# Altium schematic sheet MY_DEMO.SchDoc
size A3
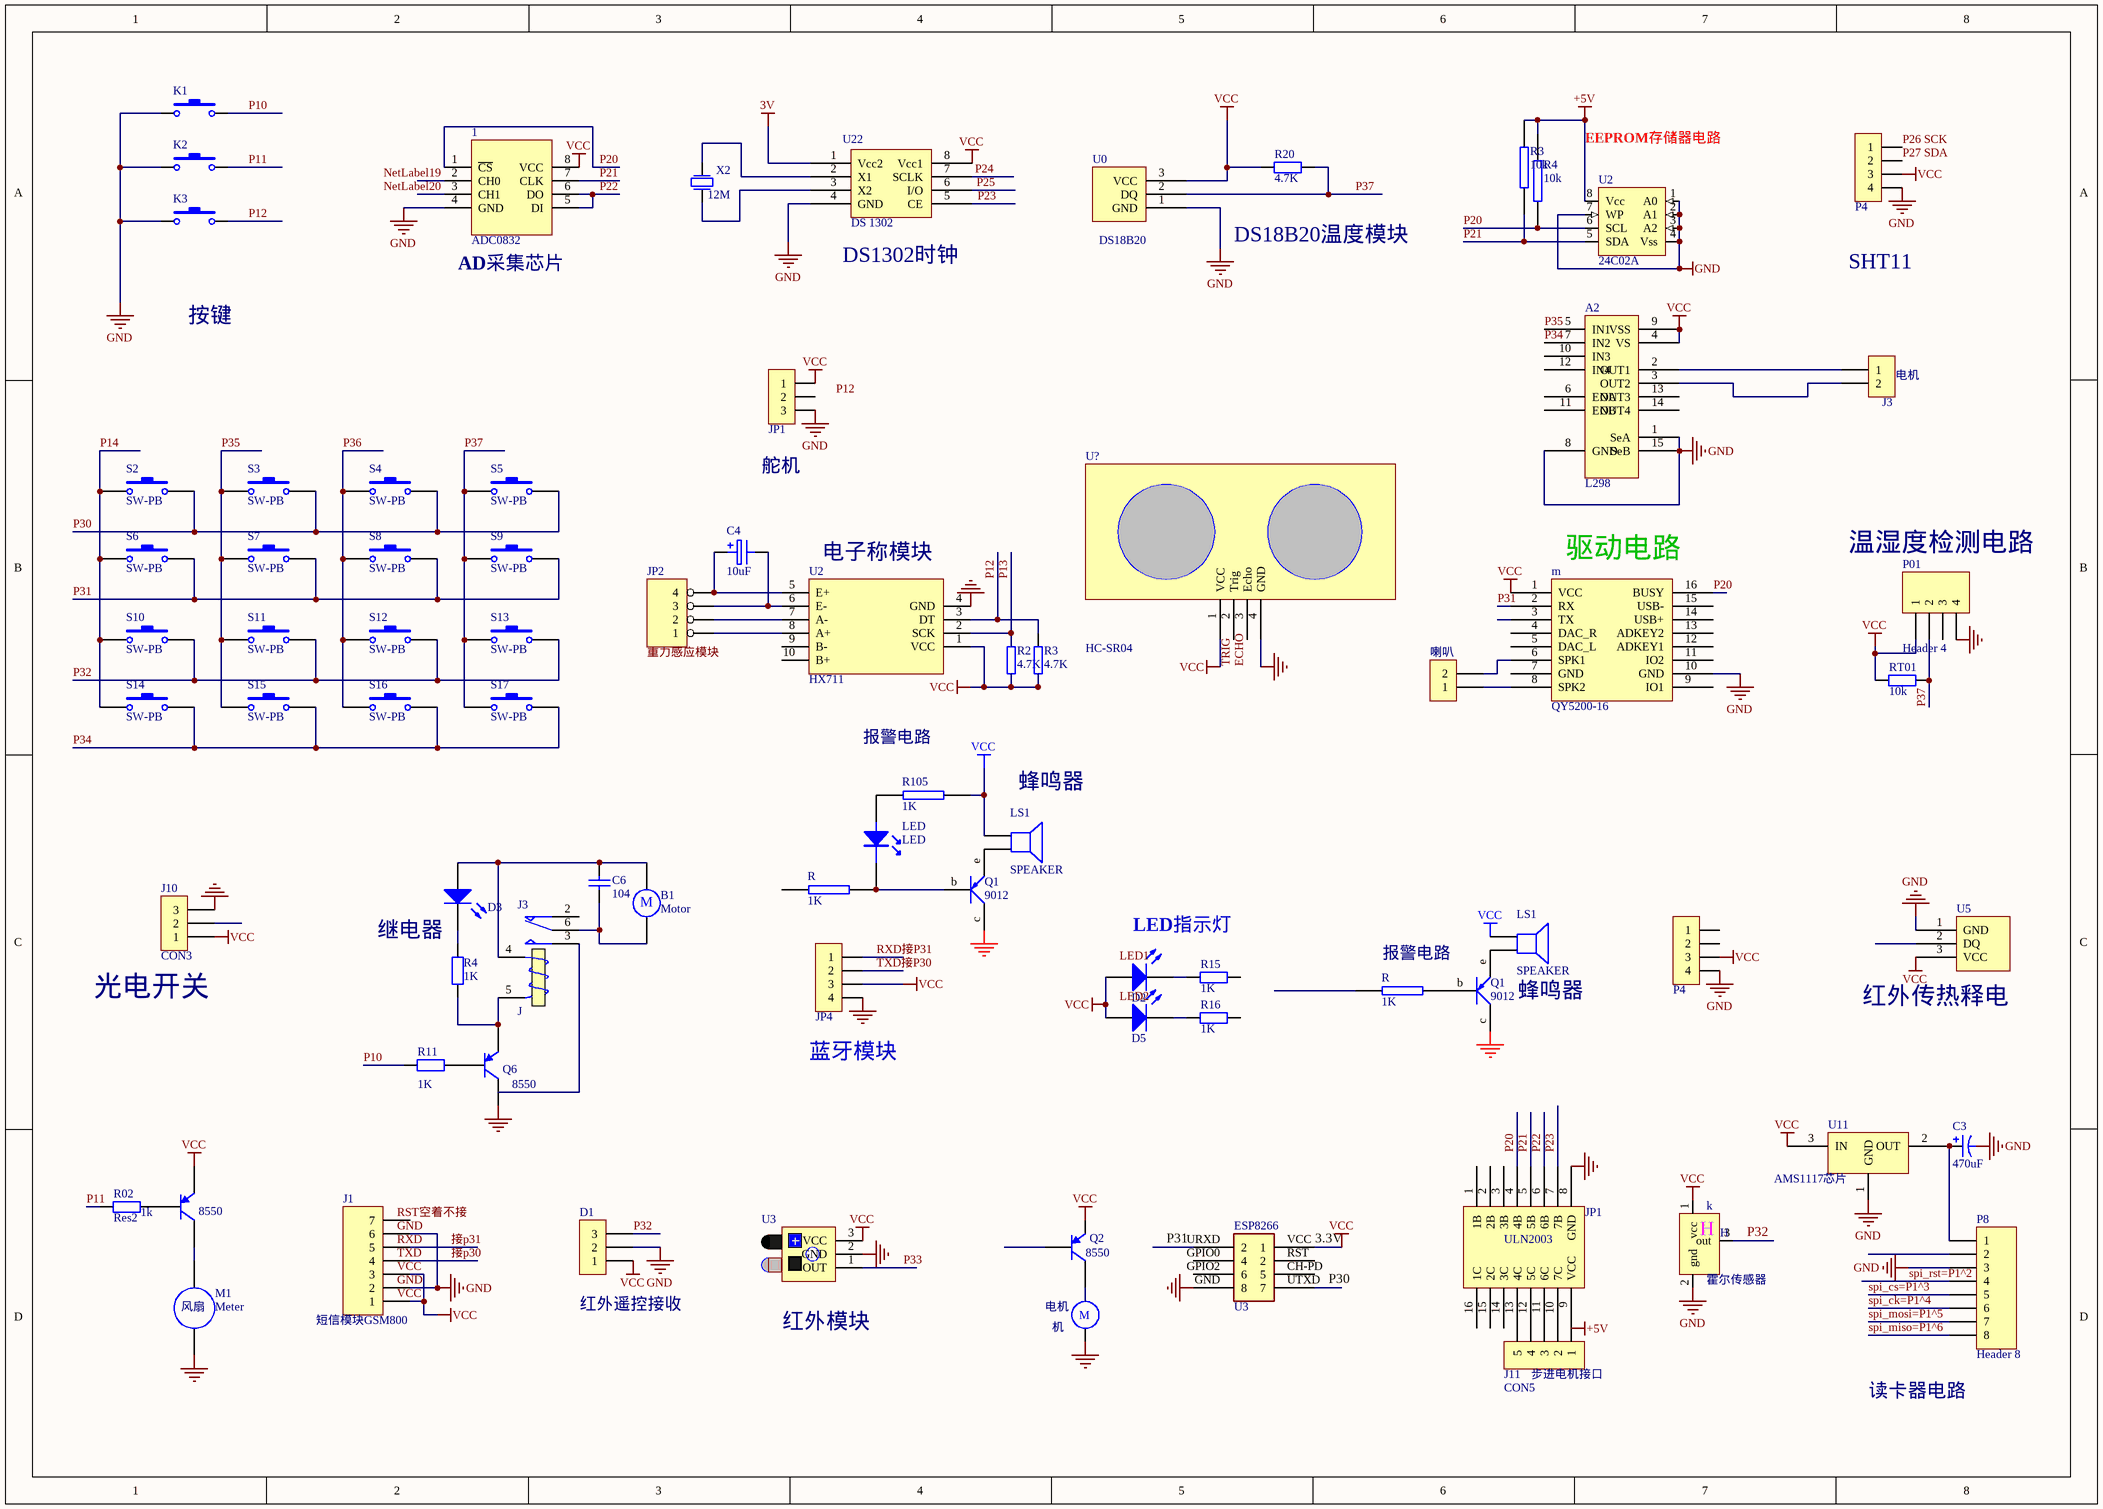
[diagram p0: MY_DEMO.SchDoc]

## Parts
(Parts that share a designator on the sheet are numbered #1, #2 ... from top to bottom, then left to right.)
1  ADC0832
?  8550  [BCY-W3/E4]
A2  L298  [MULTI15]
B1  Motor  [2ZHEN]
C3  470uF  [电解电容]
C4  10uF  [CD5.254]
C6  104  [RAD0.1]
D1  (no value)
D2  LED  [led]  (value not drawn)
D3  LED  [led]  (value not drawn)
D5  LED  [led]  (value not drawn)
ESP8266  U3  [HDR2X4]
J1  短信模块GSM800  [HDR1X7]
J3#1  电机  [SIP2]
J3#2  J  [JIDIANQI]
J10  CON3
J11  CON5  [SIP5]
JP1#1  HDR-1X3  [HDR-1X3]  (value not drawn)
JP1#2  ULN2003  [DIP16]
JP2  (no value)  [SIP4]
JP4  HDR-1X4  [HDR-1X4]  (value not drawn)
k  H  [DS18B20]
K1  KEY  [TSW SMD-4*4*1.5]  (value not drawn)
K2  KEY  [TSW SMD-4*4*1.5]  (value not drawn)
K3  KEY  [TSW SMD-4*4*1.5]  (value not drawn)
LED  LED  [LED]
LS1#1  SPEAKER
LS1#2  SPEAKER
m  QY5200-16  [QY5200]
M1  Meter  [RAD-0.1]
P01  Header 4  [HDR1X4]
P4#1  HDR-1X4  [HDR-1X4]  (value not drawn)
P4#2  HDR-1X4  [HDR-1X4]  (value not drawn)
P8  Header 8  [HDR1X8]
Q1#1  9012  [TO-92B]
Q1#2  9012  [TO-92B]
Q2  8550  [SJG-EBC]
Q6  8550  [TO-sanjiguan]
R2  4.7K  [1/4W]
R02  Res2  value 1k  [AXIAL-0.4]
R3#1  10k  [1/4W]
R3#2  4.7K  [1/4W]
R4#1  10k  [1/4W]
R4#2  1K  [RES]
R11  1K  [AXIAL-0.3]
R15  1K  [RES]
R16  1K  [RES]
R20  value 4.7K  [直插式电阻]  (hidden comment: Res2)
R105  1K  [0805]
R#1  1K  [R-DIP]
R#2  1K  [R-DIP]
RT01  value 10k  [AXIAL-0.3]  (hidden comment: Res2)
S2  SW-PB  [SPST-2]
S3  SW-PB  [SPST-2]
S4  SW-PB  [SPST-2]
S5  SW-PB  [SPST-2]
S6  SW-PB  [SPST-2]
S7  SW-PB  [SPST-2]
S8  SW-PB  [SPST-2]
S9  SW-PB  [SPST-2]
S10  SW-PB  [SPST-2]
S11  SW-PB  [SPST-2]
S12  SW-PB  [SPST-2]
S13  SW-PB  [SPST-2]
S14  SW-PB  [SPST-2]
S15  SW-PB  [SPST-2]
S16  SW-PB  [SPST-2]
S17  SW-PB  [SPST-2]
U0  DS18B20  [TO-92]
U2#1  24C02A  [DIP8]
U2#2  HX711  [HX711]
U3  (no value)
U5  红外传热释电  [DS18B20]
U11  AMS1117芯片  [AMS1117]
U22  DS 1302  [DS1302 - duplicate]
U?  HC-SR04  [HC-SR04]
X2  12M  [XTAL-3X10]
喇叭  (no value)
电机  机  [RB5-10.5]

## Nets
3.3V: 1.8(VCC) ?.1(E) A2.4(VS) A2.9(VSS) D1.1 D2.1(A) D5.1(A) ESP8266.VCC(1) J1.1 J1.3 J10.1 JP1#1.1 JP4.3 k.1(vcc) LS1#1.1 LS1#2.1 m.1(VCC) P01.1 P4#1.3 P4#2.3 R2.1 R3#2.1 R20.1 R105.1 RT01.2 U0.3(VCC) U2#2.1(VCC) U3.3(VCC) U5.3(VCC) U11.3(IN) U22.8(Vcc1) U?.1(VCC)  [also labelled VCC]
3V: U22.1(Vcc2)
+5V: JP1#2.9(VCC) R3#1.2 R4#1.2 U2#1.8(Vcc)
GND: 1.4(GND) A2.1(SeA) A2.8(GND) A2.15(SeB) D1.2 ESP8266.GND(8) J1.2 J1.6 J10.3 JP1#1.3 JP1#2.8(GND) JP4.4 k.2(gnd) K1.1 K2.1 K3.1 m.10(GND) M1.1 P01.4 P4#1.4 P4#2.4 P8.3 Q1#1.c Q1#2.c Q6.1(C) U0.1(GND) U2#1.1(A0) U2#1.2(A1) U2#1.3(A2) U2#1.4(Vss) U2#1.7(WP) U2#2.4(GND) U3.2(GND) U5.1(GND) U22.4(GND) U?.4(GND)
P10: K1.2 R11.1
P11: K2.2 R02.1
P12: K3.2 R3#2.2 U2#2.3(DT)
P13: R2.2 U2#2.2(SCK)
P14: S2.1 S6.1 S10.1 S14.1
P20: 1.1(~{CS}) JP1#2.4(4B) m.16(BUSY) R4#1.1 U2#1.6(SCL)
P21: 1.7(CLK) JP1#2.5(5B) R3#1.1 U2#1.5(SDA)
P22: 1.5(DI) 1.6(DO) JP1#2.6(6B)
P23: JP1#2.7(7B) U22.5(CE)
P24: U22.7(SCLK)
P25: U22.6(I/O)
P26 SCK: P4#1.1
P27 SDA: P4#1.2
P30: ESP8266.UTXD(7) S2.2 S3.2 S4.2 S5.2
P31: ESP8266.URXD(2) m.2(RX) S6.2 S7.2 S8.2 S9.2
P32: D1.3 k.3(out) S10.2 S11.2 S12.2 S13.2
P33: U3.1(OUT)
P34: A2.7(IN2) S14.2 S15.2 S16.2 S17.2
P35: A2.5(IN1) S3.1 S7.1 S11.1 S15.1
P36: S4.1 S8.1 S12.1 S16.1
P37: P01.2 R20.2 RT01.1 S5.1 S9.1 S13.1 S17.1 U0.2(DQ)
RXD接P31: JP4.1
spi_ck=P1^4: P8.6
spi_cs=P1^3: P8.5
spi_miso=P1^6: P8.8
spi_mosi=P1^5: P8.7
spi_rst=P1^2: P8.4
TXD接P30: JP4.2
接p30: J1.4
接p31: J1.5
Net?_2: ?.2(B) R02.2
Net?_3: ?.3(C) M1.2
NetA2_2: A2.2(OUT1) J3#1.1
NetA2_3: A2.3(OUT2) J3#1.2
NetB1_1: B1.1 C6.2 D3.1(A) J3#2.4(T1)
NetB1_2: B1.2 C6.1 J3#2.6(COM)
NetC3_1: C3.1 P8.1 U11.2(OUT)
NetC4_1: C4.1 JP2.4 U2#2.5(E+)
NetC4_2: C4.2 JP2.3 U2#2.6(E-)
NetD2_2: D2.2(K) R15.2
NetD3_2: D3.2(K) R4#2.2
NetD5_2: D5.2(K) R16.2
NetJ3#2_5: J3#2.5(T2) Q6.3(E) R4#2.1
NetJP2_1: JP2.1 U2#2.8(A+)
NetJP2_2: JP2.2 U2#2.7(A-)
NetLED_A: LED.A R105.2
NetLED_K: LED.K Q1#1.b R#1.1
NetLS1#1_2: LS1#1.2 Q1#1.e
NetLS1#2_2: LS1#2.2 Q1#2.e
Netm_6: m.6(SPK1) 喇叭.2
Netm_8: m.8(SPK2) 喇叭.1
NetQ1#2_b: Q1#2.b R#2.1
NetQ6_2: Q6.2(B) R11.2
NetU22_2: U22.2(X1) X2.1(P1)
NetU22_3: U22.3(X2) X2.2(P2)

Not connected (* = marked no-connect by the designer): 1 2(CH0) 3(CH1); A2 6(ENA) 10(IN3) 11(ENB) 12(IN4) 13(OUT3) 14(OUT4); C3 2; ESP8266 CH-PD(5) GPIO0(4) GPIO2(6) RST(2); J1 7; J3#2 2(NC) 3(NO); J10 2; J11 1 2 3 4 5; JP1#1 2; JP1#2 1(1B) 2(2B) 3(3B) 10(7C) 11(6C) 12(5C) 13(4C) 14(3C) 15(2C) 16(1C); m 3(TX) 4(DAC_R) 5(DAC_L) 7(GND) 9(IO1) 11(IO2) 12(ADKEY1) 13(ADKEY2) 14(USB+) 15(USB-); P01 3; P4#2 1 2; P8 2; Q2 1(E) 2(B) 3(C); R15 1; R16 1; R#1 2; R#2 2; U2#2 9(B-) 10(B+); U5 2(DQ); U11 1(GND); U? 2(Trig) 3(Echo); 电机 1 2

## Notes on the sheet
- EEPROM存储器电路
- DS18B20温度模块
- (near 1) AD采集芯片
- (near U22) DS1302时钟
- SHT11
- 按键
- (near m) 驱动电路
- 温湿度检测电路
- (near LS1#1) 蜂鸣器
- 继电器
- LED指示灯
- (near J10) 光电开关
- 蜂鸣器
- (near JP4) 蓝牙模块
- (near M1) 风扇
- (near U3) 红外模块
- (near J11) 步进电机接口
- 读卡器电路
- Labels drawn without touching a wire or pin: ECHO, GND, LED1, LED2, NetLabel19, NetLabel20, P12, RST空着不接, RXD, TRIG, TXD, VCC, 报警电路, 电子称模块, 红外遥控接收, 舵机, 重力感应模块, 霍尔传感器
- (in symbol Motor) M

## Library data of the parts
? = 2N3906: PNP General Purpose Amplifier; Published: 8-Jun-2000; LatestRevisionDate: 15-Jan-2003; LatestRevisionNote: PCB Footprint 'BCY-W3/D4.7' replaced; DatasheetDocument: 1997; PackageReference: TO-92A; Publisher: Altium Limited; Code_JEDEC: TO-92A
B1 电机 = Motor: Motor, General Kind; Published: 24-Mar-1999; LatestRevisionDate: 17-Jul-2002; LatestRevisionNote: Re-released for DXP Platform.; PackageReference: RB5-10.5; Publisher: Altium Limited
C3 = Cap Pol1: Polarized Capacitor (Radial); Published: 8-Jun-2000; LatestRevisionDate: 17-Jul-2002; LatestRevisionNote: Re-released for DXP Platform.; PackageReference: RB7.6-15; Publisher: Altium Limited; Value: 470uF
C4 = ELECTRO1: Electrolytic Capacitor
C6 = CAP
D1 J10 = CON3: Connector
D2 D3 D5 = LED0: Typical INFRARED GaAs LED; Published: 8-Jun-2000; LatestRevisionDate: 08-Jul-2005; LatestRevisionNote: Mech Layer 1 removed.; PackageReference: LED-0; Publisher: Altium Limited
ESP8266 = CZ8
J1 = Header 7: Header, 7-Pin; LatestRevisionDate: 17-Jul-2002; LatestRevisionNote: Re-released for DXP Platform.; Publisher: Altium Limited
J3#1 喇叭 = CON2: Connector
J3#2 = jidianqi
J11 = CON5: Connector
JP1#1 = Header 3: 3P接插件; 版权归属: 源创客; BOM名称: 3P接插件; 学习资源: www.ooocke.com
JP2 = 4 HEADER: 4 Pin Header
JP4 P4#1 P4#2 = Header 4: 4P接插件; 版权归属: 源创客; BOM名称: 4P接插件; 学习资源: www.ooocke.com
m = YX5200-16
M1 = Meter: Indicating Instrument; Note: Place a "letter" into the symbol to show the function of the meter or instrument; Published: 24-Mar-1999; LatestRevisionDate: 17-Jul-2002; LatestRevisionNote: Re-released for DXP Platform.; Publisher: Altium Limited
P01 = Header 4: Header, 4-Pin; LatestRevisionDate: 17-Jul-2002; LatestRevisionNote: Re-released for DXP Platform.; Publisher: Altium Limited
P8 = Header 8: Header, 8-Pin; LatestRevisionDate: 17-Jul-2002; LatestRevisionNote: Re-released for DXP Platform.; Publisher: Altium Limited
Q1#1 Q1#2 Q2 Q6 = PNP
R2 R3#1 R3#2 R4#1 R105 R#1 R#2 = RES2
R02 R4#2 R15 R16 R20 RT01 = Res2: Resistor; Published: 8-Jun-2000; LatestRevisionDate: 17-Jul-2002; LatestRevisionNote: Re-released for DXP Platform.; Publisher: Altium Limited
  R4#2 R15 R16: PackageReference: AXIAL-0.4; Value: 1K
  R20: PackageReference: AXIAL-0.4
R11 = RES0.4
S2-S17 = SW-PB: Switch; Published: 24-Mar-1999; LatestRevisionDate: 17-Jul-2002; LatestRevisionNote: Re-released for DXP Platform.; PackageReference: SPST-2; Publisher: Altium Limited
U2#1 = 24LC64_1: Text Field1: 50; Text Field2: 50
U3 = FC-51: Value: FC-51光电开关
U5 = DS18B20
U11 = AMS1117
U22 = DS1302
X2 = 1: Crystal Oscillator